# Altium schematic sheet Wireless+other.SchDoc
size A4
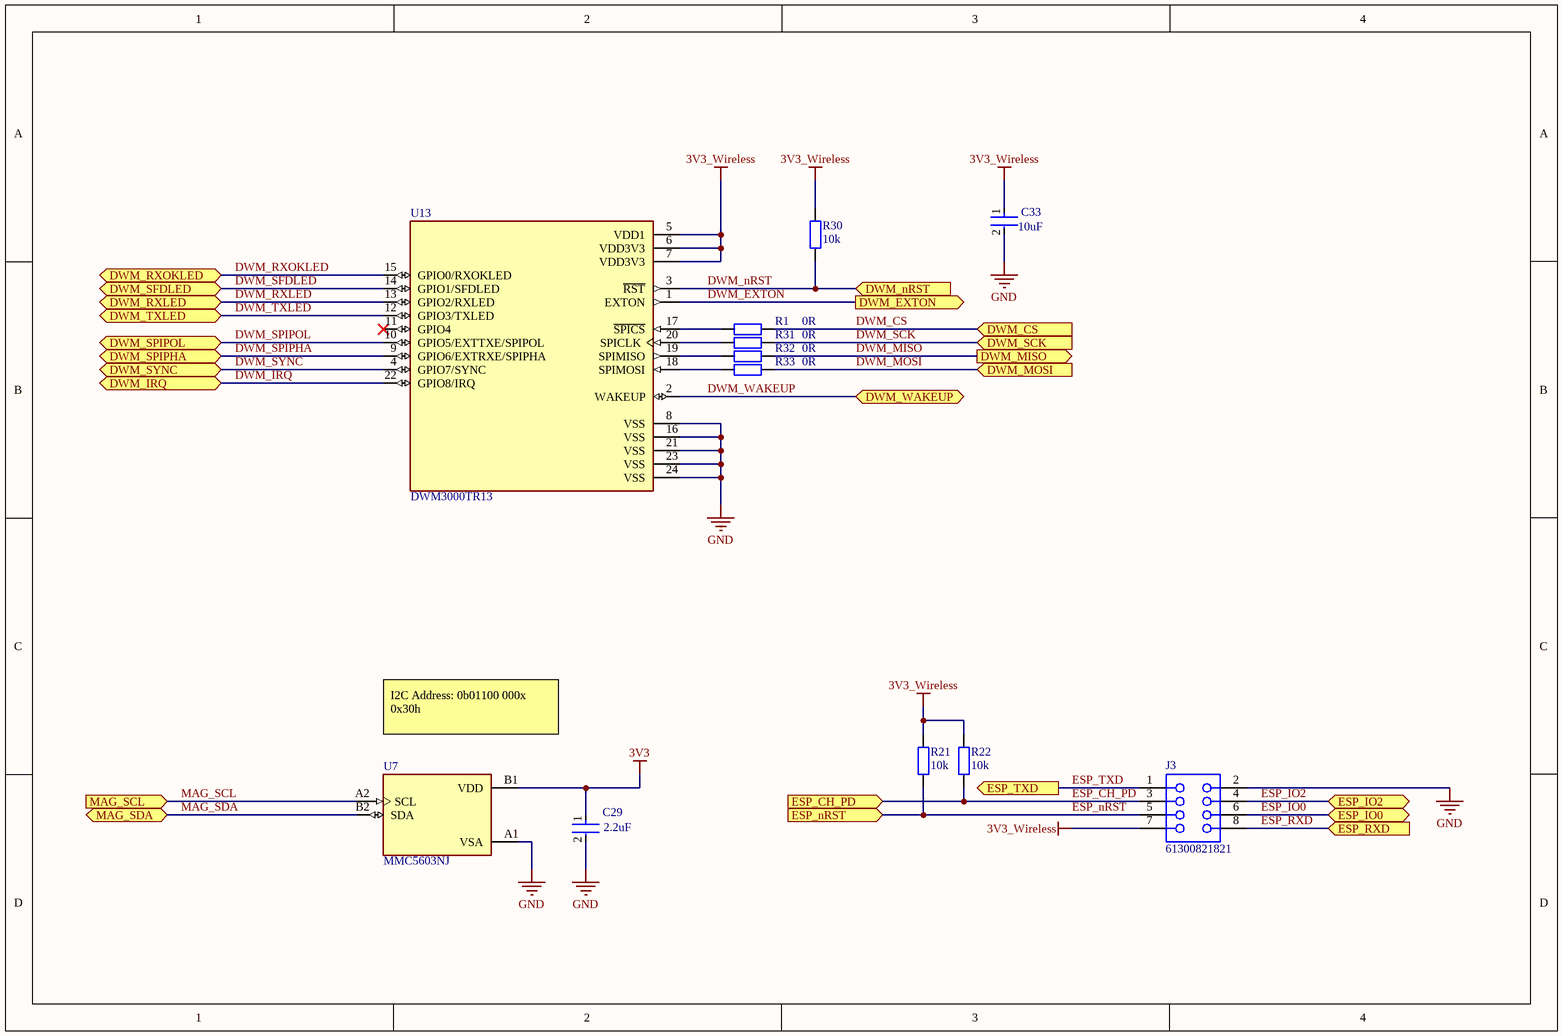
[diagram p0: Wireless+other.SchDoc]

## Parts
C29  Capacitance: 2.2uF  [FP-GRM155-0_05-MFG]  (hidden comment: GRM155R61A225KE95D)
C33  Capacitance: 10uF  [FP-GRM18-0_15-MFG]  (hidden comment: GRM188R61A106KE69D)
J3  61300821821  [61300821821]
R1  0R  [IPC C R0402 NO SILK]
R21  10k  [IPC C R0402 NO SILK]
R22  10k  [IPC C R0402 NO SILK]
R30  10k  [IPC C R0402 NO SILK]
R31  0R  [IPC C R0402 NO SILK]
R32  0R  [IPC C R0402 NO SILK]
R33  0R  [IPC C R0402 NO SILK]
U7  MMC5603NJ  [XDCR_MMC5603NJ]
U13  DWM3000TR13  [XCVR_DWM3000TR13]

## Ports
DWM_CS (in), DWM_EXTON (out), DWM_IRQ (bidir), DWM_MISO (out), DWM_MOSI (in), DWM_nRST (in), DWM_RXLED (bidir), DWM_RXOKLED (bidir), DWM_SCK (in), DWM_SFDLED (bidir), DWM_SPIPHA (bidir), DWM_SPIPOL (bidir), DWM_SYNC (bidir), DWM_TXLED (bidir), DWM_WAKEUP (bidir), ESP_CH_PD (in), ESP_IO0 (bidir), ESP_IO2 (bidir), ESP_nRST (in), ESP_RXD (in), ESP_TXD (out), MAG_SCL (in), MAG_SDA (bidir)

## Nets
3V3: C29.1 U7.B1(VDD)
3V3_Wireless: C33.1 J3.7 R21.1 R22.1 R30.2 U13.5(VDD1) U13.6(VDD3V3) U13.7(VDD3V3)
GND: C29.2 C33.2 J3.2 U7.A1(VSA) U13.8(VSS) U13.16(VSS) U13.21(VSS) U13.23(VSS) U13.24(VSS)
DWM_CS: R1.1 ; port DWM_CS
DWM_EXTON: U13.1(EXTON) ; port DWM_EXTON
DWM_IRQ: U13.22(GPIO8/IRQ) ; port DWM_IRQ
DWM_MISO: R32.1 ; port DWM_MISO
DWM_MOSI: R33.1 ; port DWM_MOSI
DWM_nRST: R30.1 U13.3(~{RST}) ; port DWM_nRST
DWM_RXLED: U13.13(GPIO2/RXLED) ; port DWM_RXLED
DWM_RXOKLED: U13.15(GPIO0/RXOKLED) ; port DWM_RXOKLED
DWM_SCK: R31.1 ; port DWM_SCK
DWM_SFDLED: U13.14(GPIO1/SFDLED) ; port DWM_SFDLED
DWM_SPIPHA: U13.9(GPIO6/EXTRXE/SPIPHA) ; port DWM_SPIPHA
DWM_SPIPOL: U13.10(GPIO5/EXTTXE/SPIPOL) ; port DWM_SPIPOL
DWM_SYNC: U13.4(GPIO7/SYNC) ; port DWM_SYNC
DWM_TXLED: U13.12(GPIO3/TXLED) ; port DWM_TXLED
DWM_WAKEUP: U13.2(WAKEUP) ; port DWM_WAKEUP
ESP_CH_PD: J3.3 R22.2 ; port ESP_CH_PD
ESP_IO0: J3.6 ; port ESP_IO0
ESP_IO2: J3.4 ; port ESP_IO2
ESP_nRST: J3.5 R21.2 ; port ESP_nRST
ESP_RXD: J3.8 ; port ESP_RXD
ESP_TXD: J3.1 ; port ESP_TXD
MAG_SCL: U7.A2(SCL) ; port MAG_SCL
MAG_SDA: U7.B2(SDA) ; port MAG_SDA
NetR1_2: R1.2 U13.17(~{SPICS})
NetR31_2: R31.2 U13.20(SPICLK)
NetR32_2: R32.2 U13.19(SPIMISO)
NetR33_2: R33.2 U13.18(SPIMOSI)

Not connected (* = marked no-connect by the designer): U13 11(GPIO4)*

## Notes on the sheet
- I2C Address: 0b01100 000x
  0x30h

## Library data of the parts
C29 = CMP-06035-063009-1: CAP CER 2.2UF 10V X5R 0402; Material: Ceramic; Tolerance: 10%; Max Operating Temperature: 85°C; Min Operating Temperature: -55°C; Weight: 0.000212oz; Lead Free: Lead Free; Case Code (Imperial): 0402; Case Code (Metric): 1005; Length: 1mm; Packaging: Tape and Reel; Depth: 0.5mm; Voltage Rating: 10V; REACH SVHC: No SVHC; Width: 0.5mm; Case/Package: 0402; RoHS Compliant: Yes; Termination: SMD/SMT; Voltage Rating (DC): 10V; Height: 0.5mm; Mount: Surface Mount; Package Quantity: 10000; Dielectric: X5R; Thickness: 0.022inch
C33 = CMP-2000-05448-2: CAP CER 10UF 10V X5R 0603; Manufacturer: Murata; Temperature Coefficient: 15%; Material: Ceramic; Tolerance: 10%; Device Class L1: Passive Components; ComponentLink2Description: Datasheet; Height: 0.95mm; Package: GRM18-0.15; Octopart: https://octopart.com/grm188r61a106ke69d-murata-22851381; Manufacturer Part Number: GRM188R61A106KE69D; Value: 10uF; Digikey Description: CAP CER 10UF 10V X5R 0603; Temperature Range High: +85°C; Temperature Range Low: -55°C; Temperature Characteristic: X5R; RoHS: TRUE; Device Class L2: Capacitors; ComponentLink2URL: https://search.murata.co.jp/Ceramy/image/img/A01X/G101/ENG/GRM188R61A106KE69-01A.pdf; Device Class L3: Ceramic Capacitors; Lead Free: Yes; Mouser Description: Multilayer Ceramic Capacitors MLCC - SMD/SMT 0603 10uF 10volts X5R + - 10%; Category: Cap; Voltage Rating: 10V; Temperature: -55°C to +85°C; Automotive: No
J3 = CMP-1502-01329-3: NexarPartId: 61924725; Operating Supply Voltage: 250V; Contact Resistance: 20mΩ; Gender: Female; Current Rating: 3A; RoHS: Non-Compliant; Lead Pitch: 2.54mm; Number of Pins: 8; Orientation: Vertical
R1 R21 R22 R30-R33 = CMP-009-00183-1: Design Item ID: Generic RES 0402; Source: Schlib1.SchLib
  R1 R31-R33: Value: 0R
  R21 R22 R30: Value: 10k
U7 = CMP-044-000000-1: Magnetoresistive Sensor X, Y, Z Axis 4-WLP (0.82x0.82); MF: Memsic Inc.; Design Item ID: MMC5603NJ; Value: *; Pin Count: 4; MP: MMC5603NJ; Check_prices: https://www.snapeda.com/parts/MMC5603NJ/Memsic+Inc./view-part/?ref=eda; Availability: In Stock; Price: None; Component Type: Standard; SnapEDA_Link: https://www.snapeda.com/parts/MMC5603NJ/Memsic+Inc./view-part/?ref=snap; Source: MMC5603NJ.SchLib; Package: UFBGA-4 Memsic Inc.; Purchase-URL: https://pricing.snapeda.com/search/part/MMC5603NJ/?ref=eda
U13 = CMP-046-000000-1: 802.15.4, Bluetooth, Cellular UWB, ZigbeeÂ® Transceiver Module 6.25GHz ~ 8.25GHz Integrated, Ceramic Patch Surface Mount; MF: Qorvo; Design Item ID: DWM3000TR13; Package: None; SnapEDA_Link: https://www.snapeda.com/parts/DWM3000TR13/Qorvo/view-part/?ref=snap; Check_prices: https://www.snapeda.com/parts/DWM3000TR13/Qorvo/view-part/?ref=eda; Value: *; MP: DWM3000TR13; Source: DWM3000TR13.SchLib; Pin Count: 24; Component Type: Standard